# Altium project GPS-Tracker.PrjPcb
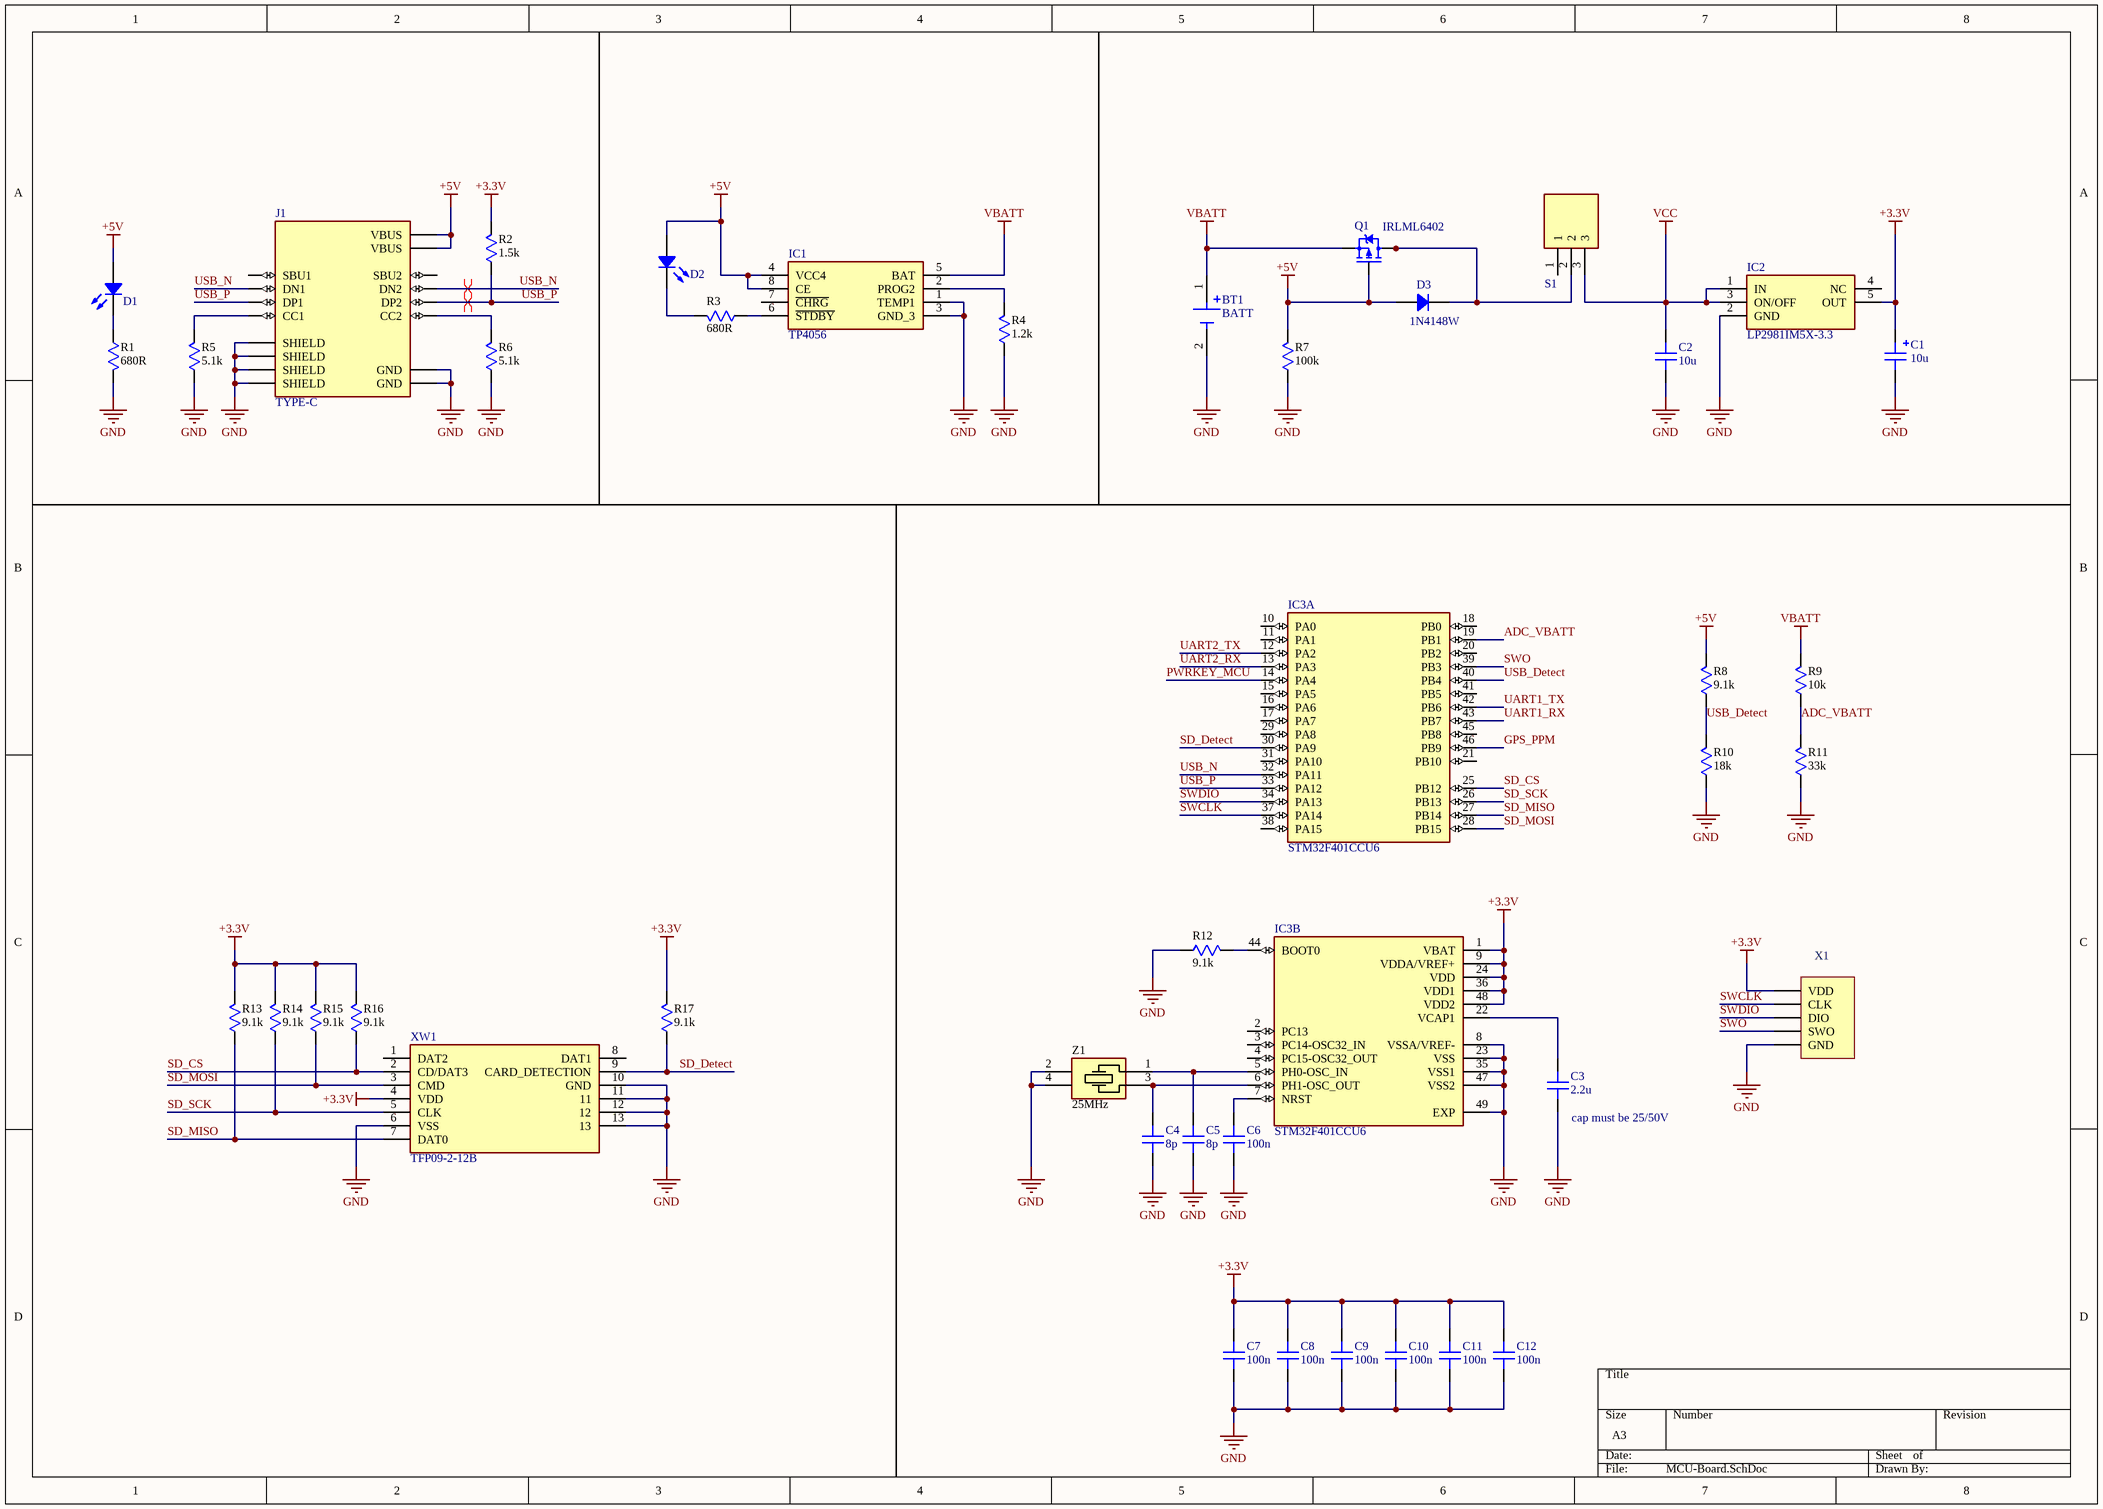
[diagram p0: MCU-Board.SchDoc]
3 sheets, 65 parts. Net scope: global (net labels, ports and power ports of the same name join across sheets).
Board file: GPS-Tracker.PcbDoc
Sheets:
  MCU-Board.SchDoc
  GPS-Board.SchDoc
  GSM-Board.SchDoc

## Sheet MCU-Board.SchDoc: MCU Board
size A3; SheetNumber: 1; SheetTotal: 3

### Parts
BT1  BATT  [CON: HOLDER 18650 x1]
C1  10u  [CAP: TANTAL-A]
C2  10u  [CAP: 0805]
C3  2.2u  [CAP: 0805]
C4  8p  [CAP: 0603]
C5  8p  [CAP: 0603]
C6  100n  [CAP: 0603]
C7  100n  [CAP: 0603]
C8  100n  [CAP: 0603]
C9  100n  [CAP: 0603]
C10  100n  [CAP: 0603]
C11  100n  [CAP: 0603]
C12  100n  [CAP: 0603]
D1  (no value)  [LED 0603_1608]
D2  (no value)  [LED 0603_1608]
D3  1N4148W  [DIODE: SOD123]
IC1  TP4056  [SOIC127P600X175-9N]
IC2  LP2981IM5X-3.3  [SOT95P280X145-5N]
IC3  STM32F401CCU6  [QFN50P700X700X60-49N-D]  (parts A,B of 2)
J1  TYPE-C  [HRO_TYPE-C-31-M-12]
Q1  IRLML6402  [SOT95P280X130-6N]
R1  value 680R  [RES: 0603]
R2  value 1.5k  [RES: 0603]
R3  value 680R  [RES: 0603]
R4  value 1.2k  [RES: 0805]
R5  value 5.1k  [RES: 0603]
R6  value 5.1k  [RES: 0603]
R7  value 100k  [RES: 0603]
R8  value 9.1k  [RES: 0603]
R9  value 10k  [RES: 0603]
R10  value 18k  [RES: 0603]
R11  value 33k  [RES: 0603]
R12  value 9.1k  [RES: 0603]
R13  value 9.1k  [RES: 0603]
R14  value 9.1k  [RES: 0603]
R15  value 9.1k  [RES: 0603]
R16  value 9.1k  [RES: 0603]
R17  value 9.1k  [RES: 0603]
S1  OS102011MA1QN1  [OS102011MA1QN1]  (value not drawn)
X1  (no value)  [CON: PLS-4]
XW1  TFP09-2-12B  [TFP09212B]
Z1  Frequency: 25MHz  [OSC: 3225]

### Nets
+3.3V: C1.1 C7.1 C8.2 C9.2 C10.2 C11.2 C12.2 IC2.5(OUT) IC3.1(VBAT) IC3.9(VDDA/VREF+) IC3.24(VDD) IC3.36(VDD1) IC3.48(VDD2) R2.2 R13.2 R14.2 R15.2 R16.2 R17.2 X1.1(VDD) XW1.4(VDD)
+5V: D1.1 D2.1 D3.1 IC1.4(VCC4) IC1.8(CE) J1.A4B9(VBUS) J1.B4A9(VBUS) Q1.3(G) R7.2 R8.2
GND: BT1.2(NEG) C1.2 C2.1 C3.1 C4.1 C5.2 C6.1 C7.2 C8.1 C9.1 C10.1 C11.1 C12.1 IC1.1(TEMP1) IC1.3(GND_3) IC2.2(GND) IC3.8(VSSA/VREF-) IC3.23(VSS) IC3.35(VSS1) IC3.47(VSS2) IC3.49(EXP) J1.A1B12(GND) J1.B1A12(GND) J1.S1(SHIELD) J1.S2(SHIELD) J1.S3(SHIELD) J1.S4(SHIELD) R1.2 R4.1 R5.1 R6.1 R7.1 R10.1 R11.1 R12.1 X1.3(GND) XW1.6(VSS) XW1.10(GND) XW1.11 XW1.12 XW1.13 Z1.2 Z1.4
VBATT: BT1.1(POS) IC1.5(BAT) Q1.4(S) R9.2
VCC: C2.2 IC2.1(IN) IC2.3(ON/OFF) S1.3
ADC_VBATT: IC3.19(PB1) R9.1 R11.2
GPS_PPM: IC3.46(PB9)
PWRKEY_MCU: IC3.14(PA4)
SD_CS: IC3.25(PB12) R16.1 XW1.2(CD/DAT3)
SD_Detect: IC3.30(PA9) R17.1 XW1.9(CARD_DETECTION)
SD_MISO: IC3.27(PB14) R13.1 XW1.7(DAT0)
SD_MOSI: IC3.28(PB15) R15.1 XW1.3(CMD)
SD_SCK: IC3.26(PB13) R14.1 XW1.5(CLK)
SWCLK: IC3.37(PA14) X1.2(CLK)
SWDIO: IC3.34(PA13) X1.4(DIO)
SWO: IC3.39(PB3) X1.5(SWO)
UART1_RX: IC3.43(PB7)
UART1_TX: IC3.42(PB6)
UART2_RX: IC3.13(PA3)
UART2_TX: IC3.12(PA2)
USB_Detect: IC3.40(PB4) R8.1 R10.2
USB_N: IC3.32(PA11) J1.A7(DN1) J1.B7(DN2)
USB_P: IC3.33(PA12) J1.A6(DP1) J1.B6(DP2) R2.1
NetC3_2: C3.2 IC3.22(VCAP1)
NetC4_2: C4.2 IC3.6(PH1-OSC_OUT) Z1.3
NetC5_1: C5.1 IC3.5(PH0-OSC_IN) Z1.1
NetC6_2: C6.2 IC3.7(NRST)
NetD1_2: D1.2 R1.1
NetD2_2: D2.2 R3.2
NetD3_2: D3.2 Q1.1(D) Q1.2(D) Q1.5(D) Q1.6(D) S1.2
NetIC1_2: IC1.2(PROG2) R4.2
NetIC1_6: IC1.6(~{STDBY}) R3.1
NetIC3_44: IC3.44(BOOT0) R12.2
NetJ1_A5: J1.A5(CC1) R5.2
NetJ1_B5: J1.B5(CC2) R6.2

Not connected (* = marked no-connect by the designer): IC1 7(~{CHRG}); IC2 4(NC); IC3 2(PC13) 3(PC14-OSC32_IN) 4(PC15-OSC32_OUT) 10(PA0) 11(PA1) 15(PA5) 16(PA6) 17(PA7) 18(PB0) 20(PB2) 21(PB10) 29(PA8) 31(PA10) 38(PA15) 41(PB5) 45(PB8); J1 A8(SBU1) B8(SBU2); S1 1; XW1 1(DAT2) 8(DAT1)

### Layout directives
differential pair: USB_N, USB_P

### Notes on the sheet
- (near C3) cap must be 25/50V

### Library data of the parts
BT1 = BATT: BATTERY; MP: BH123A; MF: MPD; Availability: Unavailable; Package: None; Value: *; Price: None; SnapEDA_Link: https://www.snapeda.com/parts/BH123A/MPD/view-part/4389037/?ref=snap
C1 = Capacitor_polar: SMD Capacitor Polar
C2-C12 = Capacitor: SMD Capacitor
D1 D2 = LED: Chip LED
D3 = Diode: Rectifier Diode
IC1 = TP4056: Connector; Manufacturer_Name: NanJing Top Power; Datasheet Link: https://dlnmh9ip6v2uc.cloudfront.net/datasheets/Prototyping/TP4056.pdf; Height: 1.75mm; Manufacturer_Part_Number: TP4056
IC2 = LP2981IM5X-3.3: Integrated Circuit; Manufacturer_Name: Texas Instruments; Manufacturer_Part_Number: LP2981IM5X-5.0; Datasheet Link: https://www.ti.com/lit/ds/symlink/lp2981-n.pdf?ts=1629199672850&ref_url=https%253A%252F%252Fwww.ti.com%252Fstore%252Fti%252Fen%252Fp%252Fproduct%252F%253Fp%253DLP2981IM5X-5.0%252FNOPB; Height: 1.45mm; Mouser Part Number: 926-LP2981IM5X-50; Mouser Price/Stock: https://www.mouser.com/Search/Refine.aspx?Keyword=926-LP2981IM5X-50
IC3 = STM32F401CCU6: Integrated Circuit; Manufacturer_Name: STMicroelectronics; Datasheet Link: http://www.st.com/web/en/resource/technical/document/datasheet/DM00086815.pdf; Height: 0.6mm; Manufacturer_Part_Number: STM32F401CCU6; Mouser Part Number: 511-STM32F401CCU6; Mouser Price/Stock: https://www.mouser.co.uk/ProductDetail/STMicroelectronics/STM32F401CCU6?qs=DqCdCwOw4%2F5VrOZQxO795A%3D%3D; Arrow Part Number: STM32F401CCU6; Arrow Price/Stock: https://www.arrow.com/en/products/stm32f401ccu6/stmicroelectronics?region=nac
J1 = TYPE-C-31-M-12: USB Connectors 24 Receptacle 1 8.94*7.3mm RoHS; Package: None; Availability: Unavailable; Value: *; MP: TYPE-C-31-M-12; Price: None
Q1 = MOSP_IRLMLS6802_SOT23: P-Channel Enhancement Mode MOSFET; ASSEMBLY: ASSEMBLY; MANF_P#: IRLML6402; VALUE: IRLML6402
R1-R17 = Resistor: Manufacturer: Yageo; PartNumber: RC0201JR-07100RL; TypeResistor: Resistor film; Power: 0.05W; Package: 0201; HelpURL: https://www.digikey.com/product-detail/en/yageo/RC0201JR-07100RL/311-100NCT-ND/1949006; ValueManufacturerPartNumber: =TypeResistor+', '+Value+', '+Tolerance+', '+Package+', '+Power+', '+Temperature; Temperature: -55...+125°C
S1 = OS102011MA1QN1: Switch; Manufacturer_Name: C & K COMPONENTS; Datasheet Link: http://www.ckswitches.com/media/1428/os.pdf; Manufacturer_Part_Number: OS102011MA1QN1; Mouser Part Number: 611-OS102011MA1QN1; Mouser Price/Stock: https://www.mouser.co.uk/ProductDetail/CK/OS102011MA1QN1?qs=WtljUlYws5R6MUgHcLkz4w%3D%3D; Arrow Part Number: OS102011MA1QN1; Arrow Price/Stock: https://www.arrow.com/en/products/os102011ma1qn1/ck?region=europe
X1 = Connector SWD: SWD Interface
XW1 = TFP09-2-12B: Connector; Manufacturer_Name: 100y; Datasheet Link: http://images.100y.com.tw/pdf_file/10-TFP09-2-12B.pdf; Height: 2.45mm; Manufacturer_Part_Number: TFP09-2-12B
Z1 = Crystal: Manufacturer: Murata Electronics; PartNumber: XRCGB25M000F0L00R0; ValueManufacturerPartNumber: Crystal, 25MHz, 6pF, ±50ppm, case 2016, -30...+85°C; LoadCapacitance: 6pF; Tolerance: ±50ppm; Package: case 2016; HelpURL: https://www.digikey.com/product-detail/en/murata-electronics-north-america/XRCGB25M000F0L00R0/490-5577-1-ND/2368391; Temperature: -30...+85°C; TypeOscilator: Crystal

## Sheet GPS-Board.SchDoc
size A4; SheetNumber: 2; SheetTotal: 3
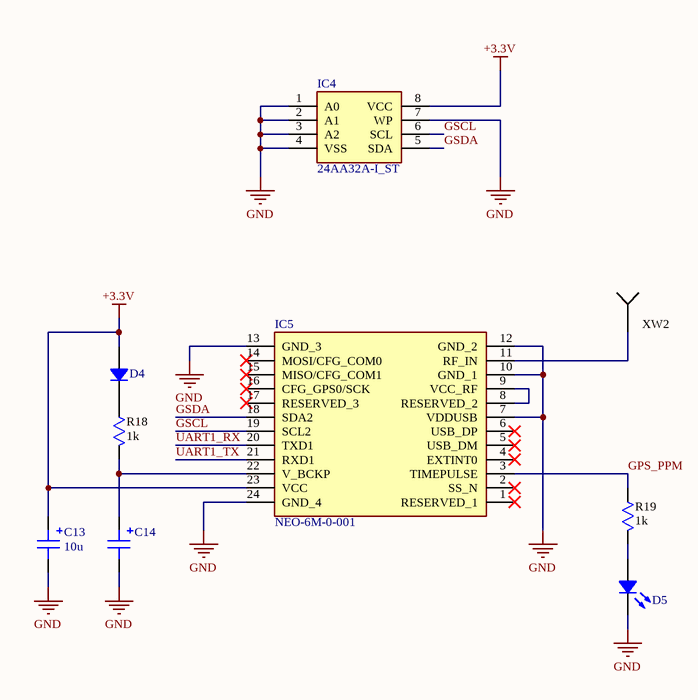
[diagram p1: GPS-Board.SchDoc]

### Parts
C13  10u  [CAP: TANTAL-A]
C14  (no value)  [CAP: IONISTOR]
D4  (no value)  [DIODE: SOD323]
D5  (no value)  [LED 0603_1608]
IC4  24AA32A-I_ST  [SOP65P640X120-8N]
IC5  NEO-6M-0-001  [NEO6M0001]
R18  value 1k  [RES: 0603]
R19  value 1k  [RES: 0603]
XW2  (no value)  [ANT: PCB]

### Nets
+3.3V: C13.1 D4.1 IC4.8(VCC) IC5.23(VCC)
GND: C13.2 C14.2 D5.2 IC4.1(A0) IC4.2(A1) IC4.3(A2) IC4.4(VSS) IC4.7(WP) IC5.7(VDDUSB) IC5.10(GND_1) IC5.12(GND_2) IC5.13(GND_3) IC5.24(GND_4)
GPS_PPM: IC5.3(TIMEPULSE) R19.1
GSCL: IC4.6(SCL) IC5.19(SCL2)
GSDA: IC4.5(SDA) IC5.18(SDA2)
UART1_RX: IC5.20(TXD1)
UART1_TX: IC5.21(RXD1)
NetC14_1: C14.1 IC5.22(V_BCKP) R18.2
NetD4_2: D4.2 R18.1
NetD5_1: D5.1 R19.2
NetIC5_8: IC5.8(RESERVED_2) IC5.9(VCC_RF)
NetIC5_11: IC5.11(RF_IN) XW2.1(SIG)

Not connected (* = marked no-connect by the designer): IC5 1(RESERVED_1)* 2(SS_N)* 4(EXTINT0)* 5(USB_DM)* 6(USB_DP)* 14(MOSI/CFG_COM0)* 15(MISO/CFG_COM1)* 16(CFG_GPS0/SCK)* 17(RESERVED_3)*

### Library data of the parts
C13 C14 = Capacitor_polar: SMD Capacitor Polar
D4 = Diode: Rectifier Diode
D5 = LED: Chip LED
IC4 = 24AA32A-I_ST: Integrated Circuit; Manufacturer_Name: Microchip; Manufacturer_Part_Number: 24AA32A-I/ST; Datasheet Link: http://ww1.microchip.com/downloads/en/DeviceDoc/21713M.pdf; Height: 1.2mm; Mouser Part Number: 579-24AA32A-I/ST; Mouser Price/Stock: https://www.mouser.co.uk/ProductDetail/Microchip-Technology/24AA32A-I-ST/?qs=z30FE1aq6wbUu0ZQUmtPYw%3D%3D; Arrow Part Number: 24AA32A-I/ST; Arrow Price/Stock: https://www.arrow.com/en/products/24aa32a-ist/microchip-technology?region=nac
IC5 = NEO-6M-0-001: Integrated Circuit; Manufacturer_Name: U-Blox; Datasheet Link: https://www.u-blox.com/sites/default/files/products/documents/NEO-6_DataSheet_%28GPS.G6-HW-09005%29.pdf; Height: 2.6mm; Manufacturer_Part_Number: NEO-6M-0-001
R18 R19 = Resistor: as R1 on sheet MCU-Board; Package: 0201; HelpURL: https://www.digikey.com/product-detail/en/yageo/RC0201JR-07100RL/311-100NCT-ND/1949006; ValueManufacturerPartNumber: =TypeResistor+', '+Value+', '+Tolerance+', '+Package+', '+Power+', '+Temperature; Temperature: -55...+125°C
XW2 = Connector RF

## Sheet GSM-Board.SchDoc
size A4; SheetNumber: 3; SheetTotal: 3
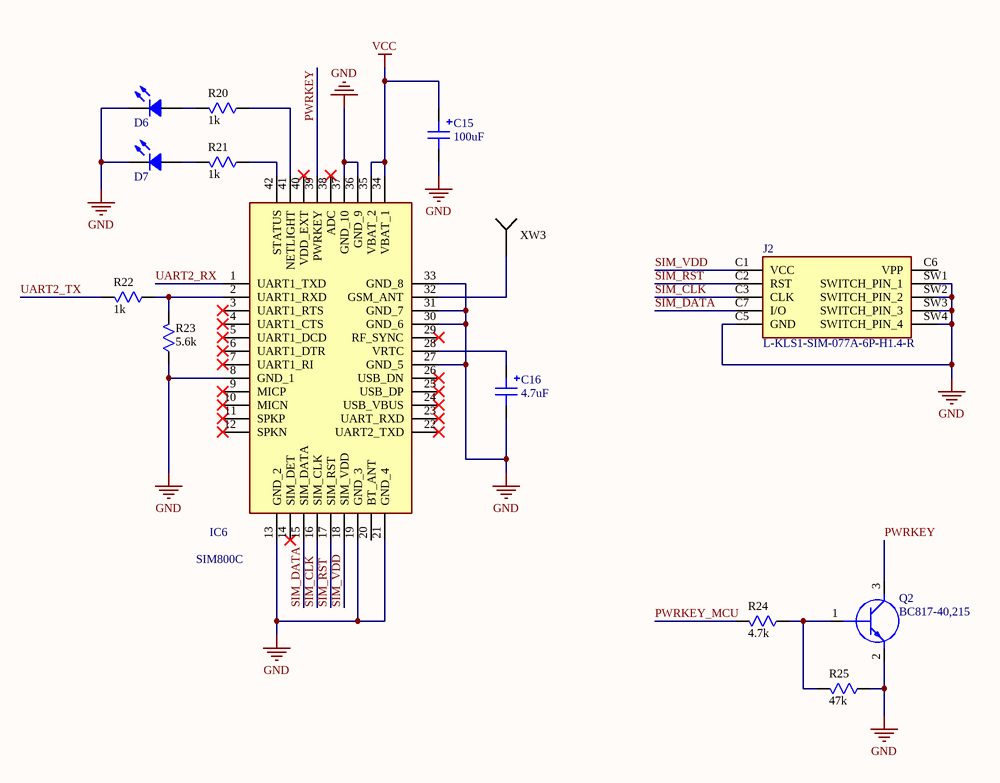
[diagram p2: GSM-Board.SchDoc]

### Parts
C15  100uF  [CAP: TANTAL-D]
C16  4.7uF  [CAP: TANTAL-A]
D6  (no value)  [LED0805]
D7  (no value)  [LED0805]
IC6  SIM800C  [SIM800C]
J2  L-KLS1-SIM-077A-6P-H1.4-R  [LKLS1SIM077A6PH14R]
Q2  BC817-40,215  [BC81740215]
R20  value 1k  [RES: 0805]
R21  value 1k  [RES: 0805]
R22  value 1k  [RES: 0805]
R23  value 5.6k  [RES: 0805]
R24  value 4.7k  [RES: 0805]
R25  value 47k  [RES: 0805]
XW3  (no value)  [CON: SMA EDGE MOUNT]

### Nets
GND: C15.2 C16.2 D6.2 D7.2 IC6.8(GND_1) IC6.13(GND_2) IC6.19(GND_3) IC6.21(GND_4) IC6.27(GND_5) IC6.30(GND_6) IC6.31(GND_7) IC6.33(GND_8) IC6.36(GND_9) IC6.37(GND_10) J2.C5(GND) J2.SW1(SWITCH_PIN_1) J2.SW2(SWITCH_PIN_2) J2.SW3(SWITCH_PIN_3) J2.SW4(SWITCH_PIN_4) Q2.2(E) R23.1 R25.1
VCC: C15.1 IC6.34(VBAT_1) IC6.35(VBAT_2)
PWRKEY: IC6.39(PWRKEY) Q2.3(C)
PWRKEY_MCU: R24.2
SIM_CLK: IC6.16(SIM_CLK) J2.C3(CLK)
SIM_DATA: IC6.15(SIM_DATA) J2.C7(I/O)
SIM_RST: IC6.17(SIM_RST) J2.C2(RST)
SIM_VDD: IC6.18(SIM_VDD) J2.C1(VCC)
UART2_RX: IC6.1(UART1_TXD)
UART2_TX: R22.2
NetC16_1: C16.1 IC6.28(VRTC)
NetD6_1: D6.1 R20.2
NetD7_1: D7.1 R21.2
NetIC6_2: IC6.2(UART1_RXD) R22.1 R23.2
NetIC6_32: IC6.32(GSM_ANT) XW3.1(SIG)
NetIC6_41: IC6.41(NETLIGHT) R20.1
NetIC6_42: IC6.42(STATUS) R21.1
NetQ2_1: Q2.1(B) R24.1 R25.2

Not connected (* = marked no-connect by the designer): IC6 3(UART1_RTS)* 4(UART1_CTS)* 5(UART1_DCD)* 6(UART1_DTR)* 7(UART1_RI)* 9(MICP)* 10(MICN)* 11(SPKP)* 12(SPKN)* 14(SIM_DET)* 20(BT_ANT) 22(UART2_TXD)* 23(UART_RXD)* 24(USB_VBUS)* 25(USB_DP)* 26(USB_DN)* 29(RF_SYNC)* 38(ADC)* 40(VDD_EXT)*; J2 C6(VPP)

### Library data of the parts
C15 C16 = Capacitor_polar: SMD Capacitor Polar
D6 D7 = LED: Chip LED
IC6 = -SIM800C: Integrated Circuit; Manufacturer_Name: SIMCOM; Datasheet Link: https://datasheet.lcsc.com/szlcsc/SIMCom-Wireless-Solutions-SIM800C-24Mbit_C69119.pdf; Manufacturer_Part_Number: -SIM800C
J2 = L-KLS1-SIM-077A-6P-H1.4-R: Connector; Manufacturer_Name: KLS Electronic; Datasheet Link: http://www.klsele.com/admin/product_upload/20190123112744L-KLS1-SIM-077A-6P-H1.4-R--.pdf; Height: 1.45mm; Manufacturer_Part_Number: L-KLS1-SIM-077A-6P-H1.4-R
Q2 = BC817-40,215: Transistor BJT NPN; Manufacturer_Name: Nexperia; Datasheet Link: https://assets.nexperia.com/documents/data-sheet/BC817_SER.pdf; Height: 1.1mm; Manufacturer_Part_Number: BC817-40,215; Mouser Part Number: 771-BC817-40-T/R; Mouser Price/Stock: https://www.mouser.co.uk/ProductDetail/Nexperia/BC817-40215?qs=me8TqzrmIYU%252B245p8hOLaQ%3D%3D; Arrow Part Number: BC817-40,215; Arrow Price/Stock: https://www.arrow.com/en/products/bc817-40215/nexperia?region=nac
R20-R25 = Resistor: as R1 on sheet MCU-Board; Package: 0201; HelpURL: https://www.digikey.com/product-detail/en/yageo/RC0201JR-07100RL/311-100NCT-ND/1949006; ValueManufacturerPartNumber: =TypeResistor+', '+Value+', '+Tolerance+', '+Package+', '+Power+', '+Temperature; Temperature: -55...+125°C
XW3 = Connector RF

## Nets that join several sheets
+3.3V: MCU-Board (21 pins), GPS-Board (C13.1 D4.1 IC4.8 IC5.23)
GND: MCU-Board (43 pins), GPS-Board (13 pins), GSM-Board (22 pins)
VCC: MCU-Board (C2.2 IC2.1 IC2.3 S1.3), GSM-Board (C15.1 IC6.34 IC6.35)
GPS_PPM: MCU-Board (IC3.46), GPS-Board (IC5.3 R19.1)
PWRKEY_MCU: MCU-Board (IC3.14), GSM-Board (R24.2)
UART1_RX: MCU-Board (IC3.43), GPS-Board (IC5.20)
UART1_TX: MCU-Board (IC3.42), GPS-Board (IC5.21)
UART2_RX: MCU-Board (IC3.13), GSM-Board (IC6.1)
UART2_TX: MCU-Board (IC3.12), GSM-Board (R22.2)